# EasyEDA schematic 1-Schematic.json
TITLE: 1bit Register; REV: 1.0; Date: 2020-09-17; Sheet: 1/1; Drawn By: tardate; Company: Your Company
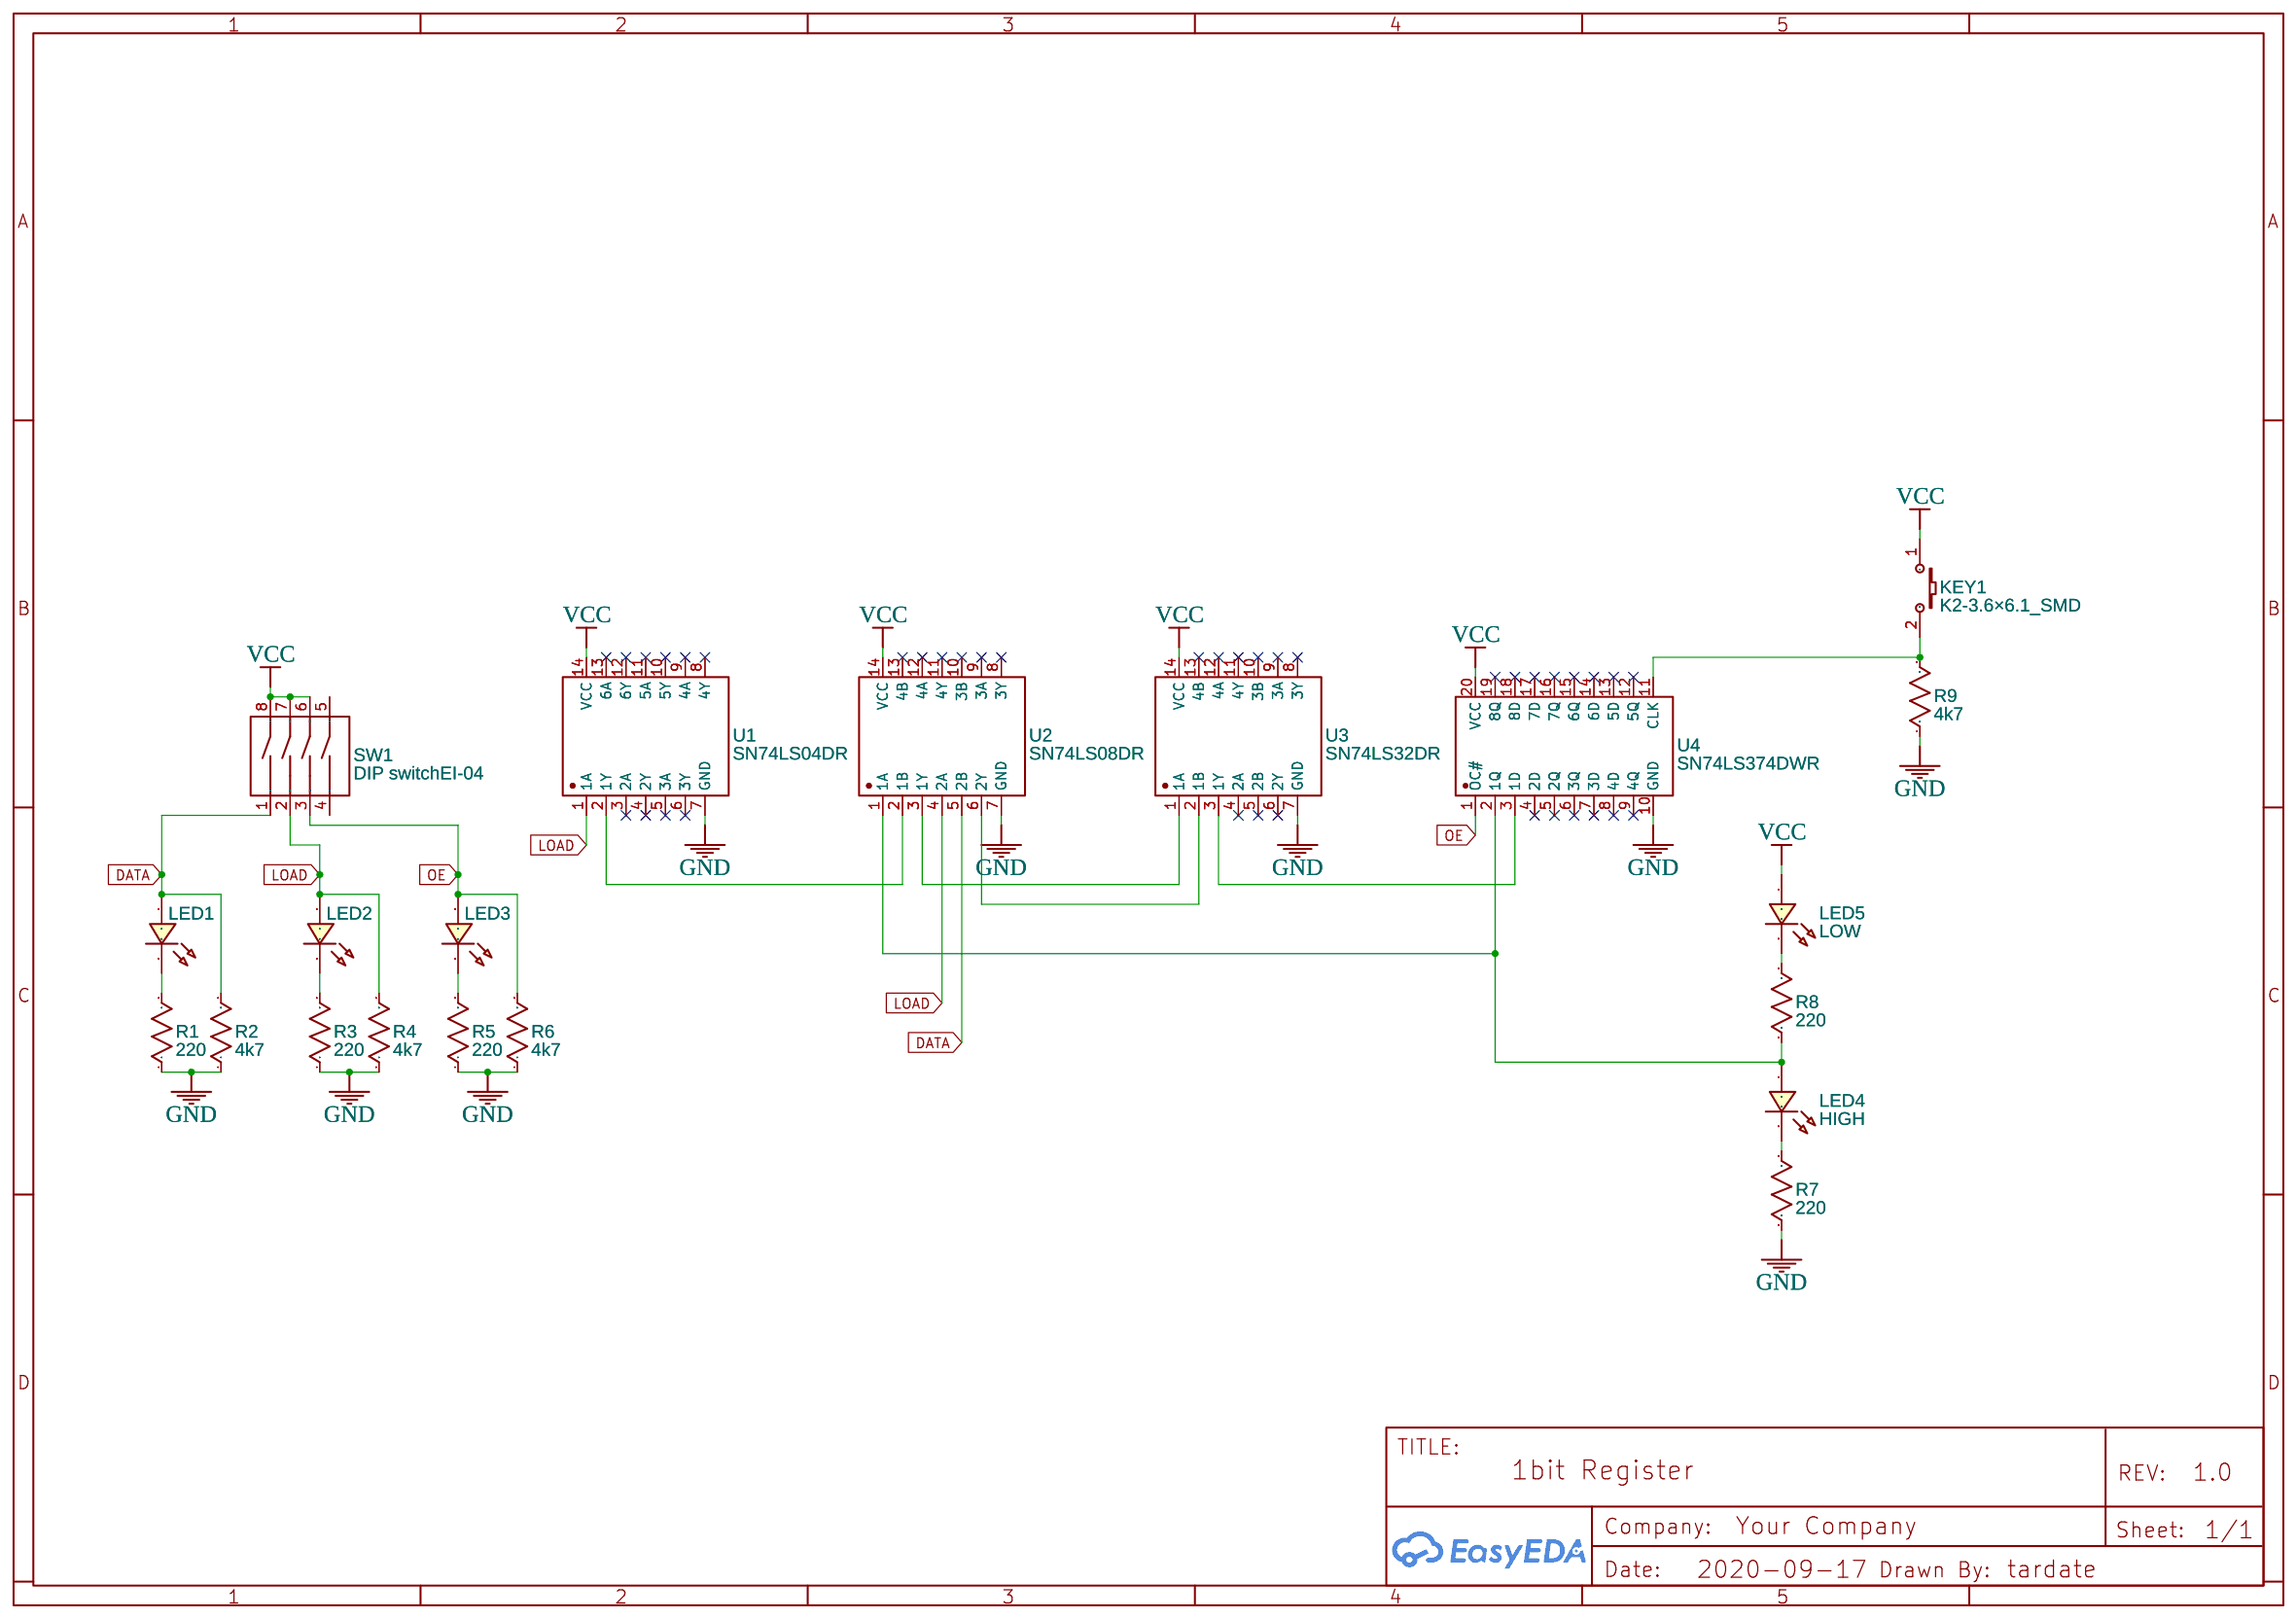
[diagram p0: schematic sheet]

## Parts
KEY1  K2-3.6×6.1_SMD  [KEY-SMD_2P-L6.2-W3.6-LS8.0]
LED1  LED-0603_R  [LED0603_RED]
LED2  LED-0603_R  [LED0603_RED]
LED3  LED-0603_R  [LED0603_RED]
LED4  HIGH  [LED0603_RED]
LED5  LOW  [LED0603_RED]
R1  220  [R0603]
R2  4k7  [R0603]
R3  220  [R0603]
R4  4k7  [R0603]
R5  220  [R0603]
R6  4k7  [R0603]
R7  220  [R0603]
R8  220  [R0603]
R9  4k7  [R0603]
SW1  DIP switchEI-04  [SW-TH_DIP SWITCHEI-04]
U1  SN74LS04DR  [SOIC-14_L8.7-W3.9-P1.27-LS6.0-BL]
U2  SN74LS08DR  [SOIC-14_L8.7-W3.9-P1.27-LS6.0-BL]
U3  SN74LS32DR  [SOIC-14_L8.7-W3.9-P1.27-LS6.0-BL]
U4  SN74LS374DWR  [SOIC-20_L13.0-W7.6-P1.27-LS10.6-BL]

## Library data of the parts
KEY1 = K2-3.6×6.1_SMD: Supplier Part: C118141; Supplier: LCSC; Manufacturer Part: K2-1107ST-A4SW-06; Contributor: LCEDA_Lib; 制造商: 韩国韩荣
LED1-LED5 = LED-0603_R: Manufacturer: EVERLIGHT(台湾亿光); Manufacturer Part: 19-217/R6C-AL1M2VY/3T; Supplier Part: C72044; Supplier: LCSC; Contributor: LCEDA_01
R1-R9 = R_0603_US: Contributor: LCEDA_Lib
SW1 = DIP switchEI-04: Supplier: LCSC; Manufacturer: DIP; Supplier Part: C99987
U1 = SN74LS04DR: Supplier: LCSC; Manufacturer: TI; Supplier Part: C6796; LCSC Assembly: Yes; SMT Type: Extend
U2 = SN74LS08DR: Supplier: LCSC; Manufacturer: TI; image: //image.lceda.cn/szlcsc/C6802.jpg; Supplier Part: C6802; LCSC Assembly: Yes; SMT Type: Extend
U3 = SN74LS32DR: Supplier: LCSC; Manufacturer: TI; Contributor: LCSC; Supplier Part: C116812; LCSC Assembly: Yes; SMT Type: Extend
U4 = SN74LS374DWR: Supplier: LCSC; Manufacturer: TI; image: //image.lceda.cn/szlcsc/C7763.jpg; Supplier Part: C7763; LCSC Assembly: Yes; SMT Type: Extend

## Nets
GND: R1.1 R2.1 R3.1 R4.1 R5.1 R6.1 R7.1 R9.1 U1.7(GND) U2.7(GND) U3.7(GND) U4.10(GND)
VCC: KEY1.1 LED5.1 SW1.6 SW1.7 SW1.8 U1.14(VCC) U2.14(VCC) U3.14(VCC) U4.20(VCC)
DATA: LED1.1 R2.2 SW1.1 U2.5(2B)
LOAD: LED2.1 R4.2 SW1.2 U1.1(1A) U2.4(2A)
OE: LED3.1 R6.2 SW1.3 U4.1(OC#)
Net-(KEY1-2): KEY1.2 R9.2 U4.11(CLK)
Net-(LED1-2): LED1.2 R1.2
Net-(LED2-2): LED2.2 R3.2
Net-(LED3-2): LED3.2 R5.2
Net-(LED4-1): LED4.1 R8.1 U2.1(1A) U4.2(1Q)
Net-(LED4-2): LED4.2 R7.2
Net-(LED5-2): LED5.2 R8.2
Net-(U1-2): U1.2(1Y) U2.2(1B)
Net-(U2-3): U2.3(1Y) U3.1(1A)
Net-(U2-6): U2.6(2Y) U3.2(1B)
Net-(U3-3): U3.3(1Y) U4.3(1D)

Not connected (* = marked no-connect by the designer): SW1 4 5; U1 3(2A)* 4(2Y)* 5(3A)* 6(3Y)* 8(4Y)* 9(4A)* 10(5Y)* 11(5A)* 12(6Y)* 13(6A)*; U2 8(3Y)* 9(3A)* 10(3B)* 11(4Y)* 12(4A)* 13(4B)*; U3 4(2A)* 5(2B)* 6(2Y)* 8(3Y)* 9(3A)* 10(3B)* 11(4Y)* 12(4A)* 13(4B)*; U4 4(2D)* 5(2Q)* 6(3Q)* 7(3D)* 8(4D)* 9(4Q)* 12(5Q)* 13(5D)* 14(6D)* 15(6Q)* 16(7Q)* 17(7D)* 18(8D)* 19(8Q)*
